# Altium schematic sheet SmartCard.SchDoc
size A4; Revision: C.2(PCB.SCH)
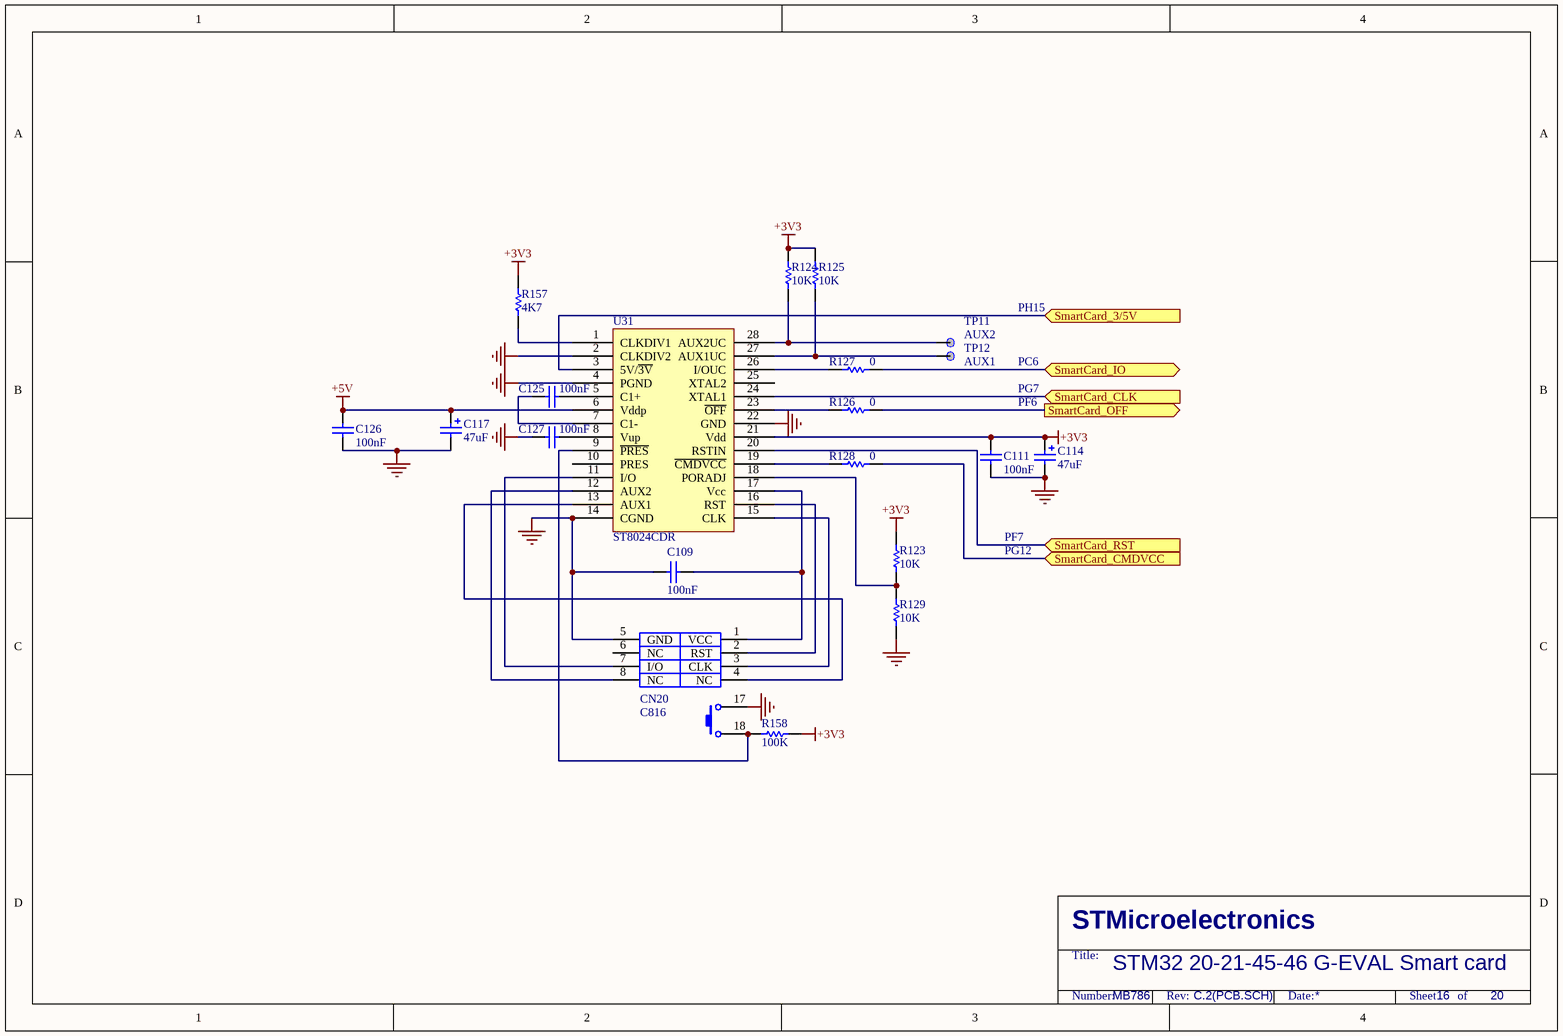
[diagram p0: SmartCard.SchDoc]

## Parts
C109  100nF  [0402C]
C111  100nF  [0402C]
C114  47uF  [TAN-B]
C117  47uF  [TAN-B]
C125  100nF  [0402C]
C126  100nF  [0402C]
C127  100nF  [0402C]
CN20  C816  [SAM(C816)]
R123  10K  [0402R]
R124  10K  [0402R]
R125  10K  [0402R]
R126  0  [0603R]
R127  0  [0603R]
R128  0  [0603R]
R129  10K  [0402R]
R157  4K7  [0402R]
R158  100K  [0402R]
TP11  AUX2  [TP]
TP12  AUX1  [TP]
U31  ST8024CDR  [SO28]

## Ports
SmartCard_3/5V (in), SmartCard_CLK (in), SmartCard_CMDVCC (in), SmartCard_IO (bidir), SmartCard_OFF (out), SmartCard_RST (in)

## Nets
+3V3: C111.1 C114.1 R123.1 R124.1 R125.1 R157.1 R158.1 U31.21(Vdd)
+5V: C117.1 C126.1 U31.6(Vddp)
GND: C109.1 C111.2 C114.2 C117.2 C126.2 C127.2 CN20.5(GND) CN20.17 R129.2 U31.2(CLKDIV2) U31.4(PGND) U31.14(CGND) U31.22(GND)
SmartCard_3/5V: U31.3(5V/~{3V}) ; port SmartCard_3/5V
SmartCard_CLK: U31.24(XTAL1) ; port SmartCard_CLK
SmartCard_CMDVCC: R128.1 ; port SmartCard_CMDVCC
SmartCard_IO: R127.2 ; port SmartCard_IO
SmartCard_OFF: R126.1 ; port SmartCard_OFF
SmartCard_RST: U31.20(RSTIN) ; port SmartCard_RST
NetC109_2: C109.2 CN20.1(VCC) U31.17(Vcc)
NetC125_1: C125.1 U31.7(C1-)
NetC125_2: C125.2 U31.5(C1+)
NetC127_1: C127.1 U31.8(Vup)
NetCN20_2: CN20.2(RST) U31.16(RST)
NetCN20_3: CN20.3(CLK) U31.15(CLK)
NetCN20_4: CN20.4(NC) U31.13(AUX1)
NetCN20_7: CN20.7(I/O) U31.11(I/O)
NetCN20_8: CN20.8(NC) U31.12(AUX2)
NetCN20_18: CN20.18 R158.2 U31.9(~{PRES})
NetR123_2: R123.2 R129.1 U31.18(PORADJ)
NetR124_2: R124.2 TP11.1 U31.28(AUX2UC)
NetR125_2: R125.2 TP12.1 U31.27(AUX1UC)
NetR126_2: R126.2 U31.23(~{OFF})
NetR127_1: R127.1 U31.26(I/OUC)
NetR128_2: R128.2 U31.19(~{CMDVCC})
NetR157_2: R157.2 U31.1(CLKDIV1)

Not connected (* = marked no-connect by the designer): CN20 6(NC); U31 10(PRES) 25(XTAL2)

## Notes on the sheet
- PH15
- PC6
- PF6
- PG7
- PF7
- PG12
- STM32 20-21-45-46 G-EVAL Smart card
- MB786
- 16
- 20
- STMicroelectronics
- Title:
- Number:
- Rev:
- Date:
- Sheet       of

## Library data of the parts
C109 C111 C125-C127 = CAP: Capacitor; Published: 8-Jun-2000; Revision: July-2002: Re-released for DXP Platform.; Publisher: Altium Limited; Value: 100nF
C114 C117 = Cap Pol1: Polarized Capacitor (Radial); Value: 100pF; Published: 8-Jun-2000; Revision: July-2002: Re-released for DXP Platform.; Publisher: Altium Limited
CN20 = Smart_card_CN
R123-R129 R157 R158 = Res1: Resistor; Value: 1K; Published: 8-Jun-2000; Revision: July-2002: Re-released for DXP Platform.; Publisher: Altium Limited
TP11 TP12 = TP
U31 = ST8024CTR